# EAGLE design TripWire (EAGLE 6.1)
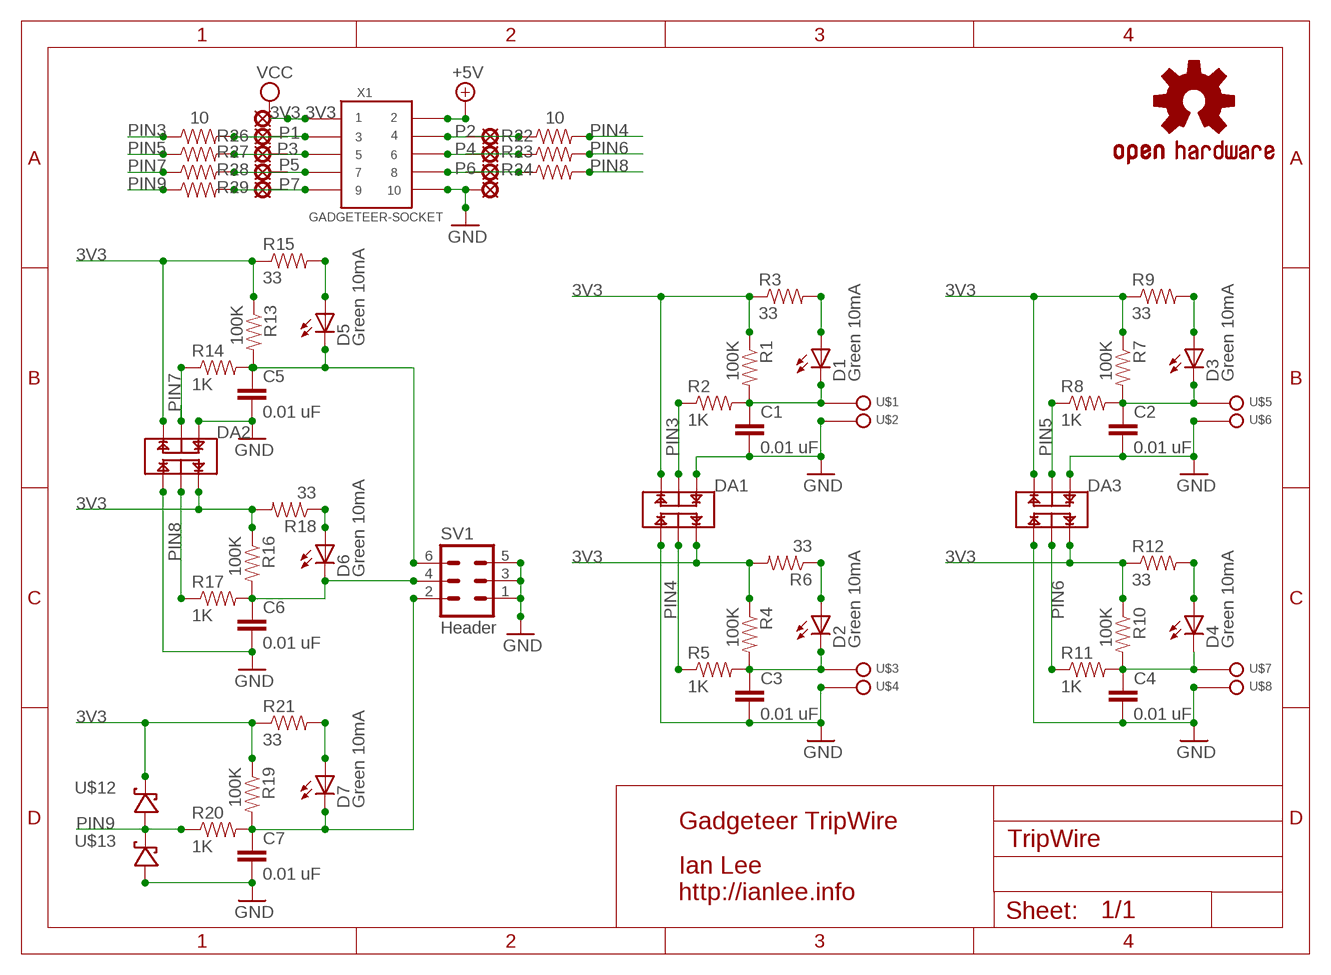
[diagram p0: schematic, sheet 1]

## Parts
3V3  LSP11  [LSP11]
C1  0.01 uF  CAP0603-CAP  [0603-CAP]
C2  0.01 uF  CAP0603-CAP  [0603-CAP]
C3  0.01 uF  CAP0603-CAP  [0603-CAP]
C4  0.01 uF  CAP0603-CAP  [0603-CAP]
C5  0.01 uF  CAP0603-CAP  [0603-CAP]
C6  0.01 uF  CAP0603-CAP  [0603-CAP]
C7  0.01 uF  CAP0603-CAP  [0603-CAP]
D1  Green 10mA  LED-YELLOW0603  [LED-0603]
D2  Green 10mA  LED-YELLOW0603  [LED-0603]
D3  Green 10mA  LED-YELLOW0603  [LED-0603]
D4  Green 10mA  LED-YELLOW0603  [LED-0603]
D5  Green 10mA  LED-YELLOW0603  [LED-0603]
D6  Green 10mA  LED-YELLOW0603  [LED-0603]
D7  Green 10mA  LED-YELLOW0603  [LED-0603]
DA1  BAT54SDW  [SOT-363]
DA2  BAT54SDW  [SOT-363]
DA3  BAT54SDW  [SOT-363]
GND  LSP11  [LSP11]
LOGO1  OSHW-LOGOM  [OSHW-LOGO-M]
P1  LSP11  [LSP11]
P2  LSP11  [LSP11]
P3  LSP11  [LSP11]
P4  LSP11  [LSP11]
P5  LSP11  [LSP11]
P6  LSP11  [LSP11]
P7  LSP11  [LSP11]
R1  100K  RESISTOR0603-RES  [0603-RES]
R2  1K  RESISTOR0603-RES  [0603-RES]
R3  33  RESISTOR0603-RES  [0603-RES]
R4  100K  RESISTOR0603-RES  [0603-RES]
R5  1K  RESISTOR0603-RES  [0603-RES]
R6  33  RESISTOR0603-RES  [0603-RES]
R7  100K  RESISTOR0603-RES  [0603-RES]
R8  1K  RESISTOR0603-RES  [0603-RES]
R9  33  RESISTOR0603-RES  [0603-RES]
R10  100K  RESISTOR0603-RES  [0603-RES]
R11  1K  RESISTOR0603-RES  [0603-RES]
R12  33  RESISTOR0603-RES  [0603-RES]
R13  100K  RESISTOR0603-RES  [0603-RES]
R14  1K  RESISTOR0603-RES  [0603-RES]
R15  33  RESISTOR0603-RES  [0603-RES]
R16  100K  RESISTOR0603-RES  [0603-RES]
R17  1K  RESISTOR0603-RES  [0603-RES]
R18  33  RESISTOR0603-RES  [0603-RES]
R19  100K  RESISTOR0603-RES  [0603-RES]
R20  1K  RESISTOR0603-RES  [0603-RES]
R21  33  RESISTOR0603-RES  [0603-RES]
R22  10  RESISTOR0603-RES  [0603-RES]
R23  10  RESISTOR0603-RES  [0603-RES]
R24  10  RESISTOR0603-RES  [0603-RES]
R26  10  RESISTOR0603-RES  [0603-RES]
R27  10  RESISTOR0603-RES  [0603-RES]
R28  10  RESISTOR0603-RES  [0603-RES]
R29  10  RESISTOR0603-RES  [0603-RES]
SV1  Header  MA03-2  [MA03-2]
U$1  SPADE-TERMINALPTH  [SPADE-TERMINAL]
U$2  SPADE-TERMINALPTH  [SPADE-TERMINAL]
U$3  SPADE-TERMINALPTH  [SPADE-TERMINAL]
U$4  SPADE-TERMINALPTH  [SPADE-TERMINAL]
U$5  SPADE-TERMINALPTH  [SPADE-TERMINAL]
U$6  SPADE-TERMINALPTH  [SPADE-TERMINAL]
U$7  SPADE-TERMINALPTH  [SPADE-TERMINAL]
U$8  SPADE-TERMINALPTH  [SPADE-TERMINAL]
U$12  BAT42-SCHOTTKY-DIODE  [SOD-523F]
U$13  BAT42-SCHOTTKY-DIODE  [SOD-523F]
X1  GADGETEER-SOCKET  [2X5_1.27MM]

## Nets
3V3 [power]: 3V3.MP DA1.P$1(C2) DA1.P$4(C1) DA2.P$1(C2) DA2.P$4(C1) DA3.P$1(C2) DA3.P$4(C1) R1.1 R3.1 R4.1 R6.2 R7.1 R9.1 R10.1 R12.1 R13.1 R15.1 R16.1 R18.2 R19.1 R21.1 U$12.P$1 X1.1 ; supply symbol labelled VCC
+5V: X1.2
GND [power]: C1.2 C2.2 C3.2 C4.2 C5.2 C6.2 C7.2 DA1.P$2(A2) DA1.P$3(A1) DA2.P$2(A2) DA2.P$3(A1) DA3.P$2(A2) DA3.P$3(A1) GND.MP SV1.1 SV1.3 SV1.5 U$2.P$1 U$4.P$1 U$6.P$1 U$8.P$1 U$13.P$2 X1.10
N$1: D1.A R3.2
N$2: C3.1 D2.C R4.2 R5.2 U$3.P$1
N$3: D2.A R6.1
N$4: C2.1 D3.C R7.2 R8.2 U$5.P$1
N$5: D3.A R9.2
N$6: C7.1 D7.C R19.2 R20.2 SV1.2
N$7: D4.A R12.2
N$8: C4.1 D4.C R10.2 R11.2 U$7.P$1
N$9: C6.1 D6.C R16.2 R17.2 SV1.4
N$10: D7.A R21.2
N$11: C1.1 D1.C R1.2 R2.2 U$1.P$1
N$12: D6.A R18.1
N$13: D5.A R15.2
N$14: C5.1 D5.C R13.2 R14.2 SV1.6
N$15: P2.MP R22.1 X1.4
N$16: P4.MP R23.1 X1.6
N$17: P6.MP R24.1 X1.8
N$18: P1.MP R26.2 X1.3
N$19: P3.MP R27.2 X1.5
N$20: P5.MP R28.2 X1.7
N$21: P7.MP R29.2 X1.9
PIN3: DA1.P$5(AC2) R2.1 R26.1
PIN4: DA1.P$0(AC1) R5.1 R22.2
PIN5: DA3.P$5(AC2) R8.1 R27.1
PIN6: DA3.P$0(AC1) R11.1 R23.2
PIN7: DA2.P$5(AC2) R14.1 R28.1
PIN8: DA2.P$0(AC1) R17.1 R24.2
PIN9: R20.1 R29.1 U$12.P$2 U$13.P$1

## Notes on the sheet
- Gadgeteer TripWire
- Ian Lee
  http://ianlee.info

## Library data of the parts
3V3 GND P1-P7 = solpad:LSP11: SOLDER PAD drill 1.1 mm
C1-C7 = SparkFun-Capacitors:CAP: Capacitor Standard 0603 ceramic capacitor, and 0.1" leaded capacitor.
D1-D7 = SparkFun-LED:LED-YELLOW: Yellow SMD LEDs LilyPad 1206- DIO-09909 0603- DIO-09003; PROD_ID: DIO-09003
DA1-DA3 = SoftDust:BAT54SDW
LOGO1 = SparkFun-Aesthetics:OSHW-LOGO: Open Source Hardware Logo This logo indicates the piece of hardware it is found on incorporates a OSHW license and/or adheres to the definition of open source hardware found here: http://freedomdefined.org/OSHW
R1-R24 R26-R29 = SparkFun-Resistors:RESISTOR: Resistor Basic schematic elements and footprints for 0603, 1206, and PTH resistors.
SV1 = con-lstb:MA03-2: PIN HEADER; OC_FARNELL: unknown; OC_NEWARK: unknown
U$1-U$8 = SoftDust:SPADE-TERMINAL
U$12 U$13 = SoftDust:BAT42-SCHOTTKY-DIODE
X1 = SoftDust:GADGETEER-SOCKET

## Net classes
0 default: width 0.152 mm, drill 0.254 mm, clearance 0.203 mm

## Board
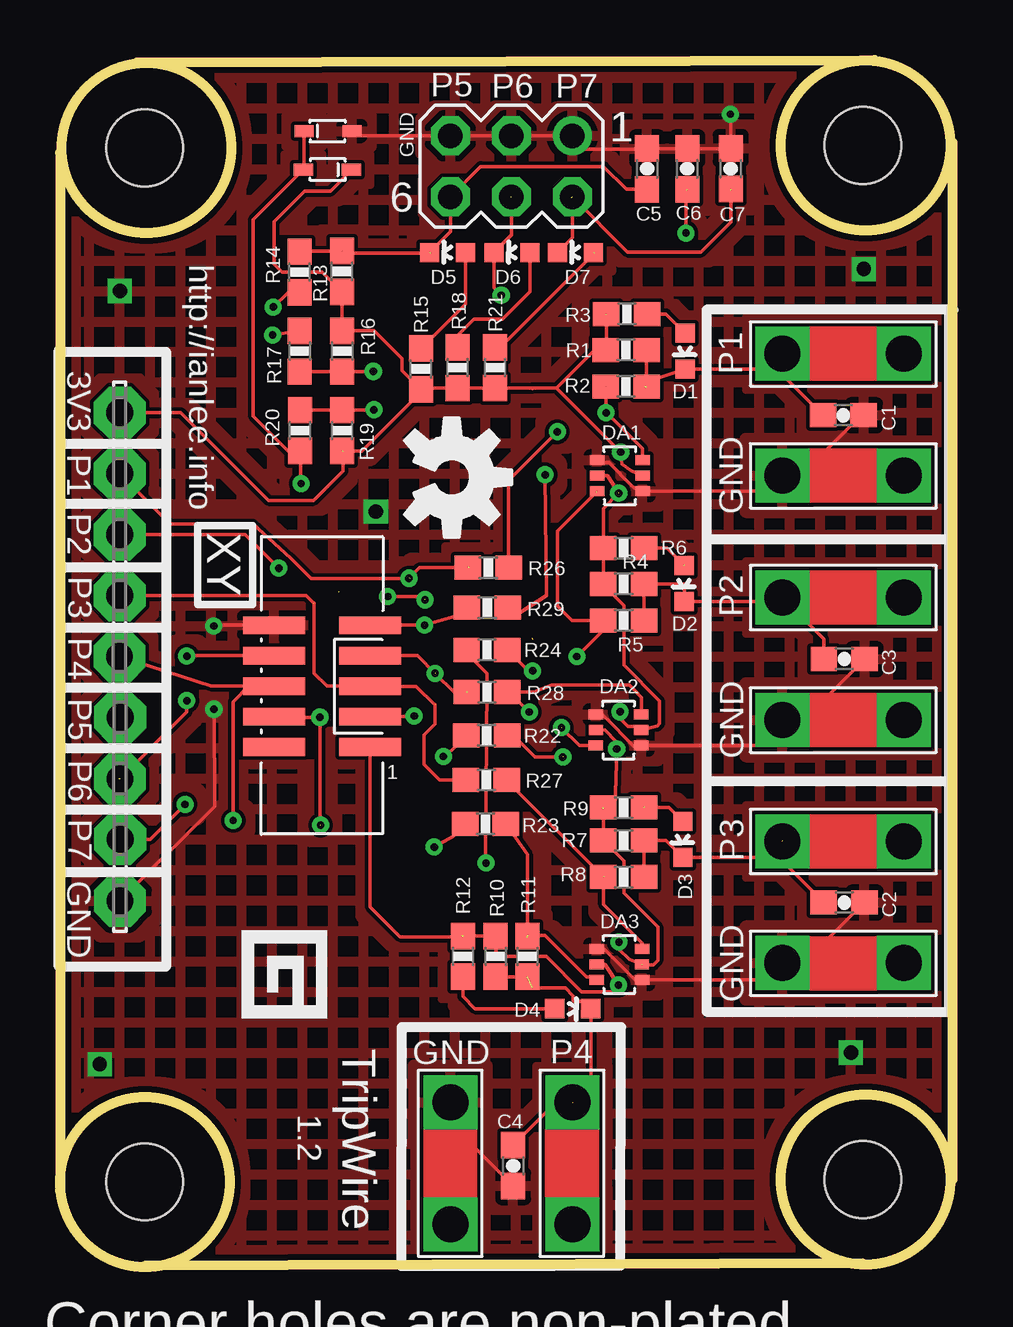
[diagram p1: board, top side]
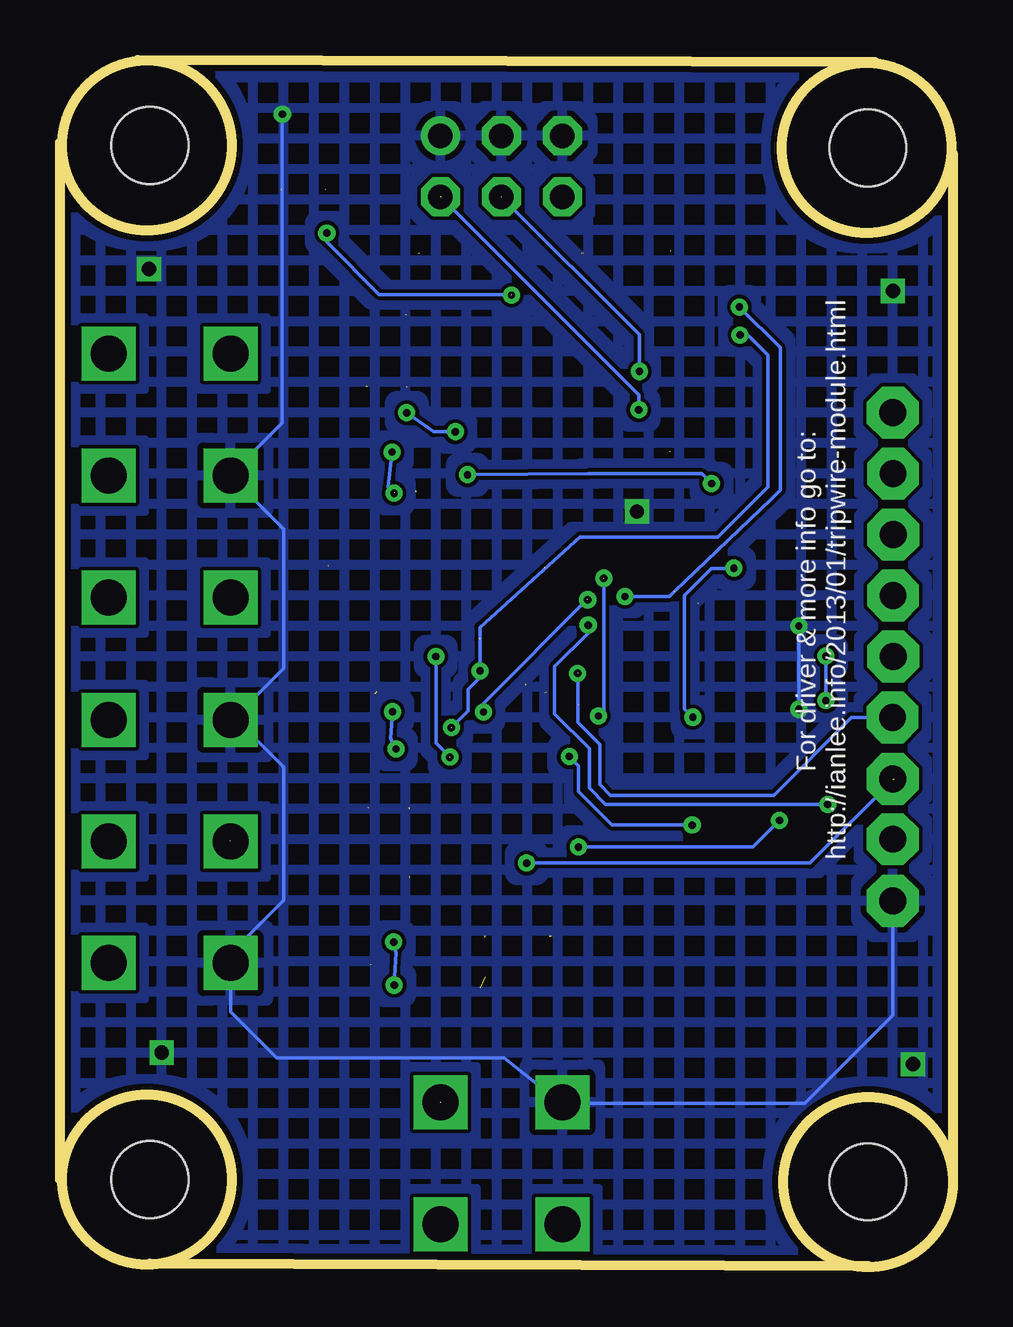
[diagram p2: board, bottom side, seen from below]

Size 37.22 x 50.3 mm. Coordinates in mm from the lower left corner, seen from the top.
Outline: 37.22,3.64 37.22,46.87
Outline: 0.01,46.42 0.01,3.18
Outline: 33.46,0.14 3.54,0.04
Outline: 3.21,50.2 33.97,50.3
Outline: circle at 33.59,3.64 radius 3.54
Outline: circle at 3.54,3.54 radius 3.54
Outline: circle at 33.59,46.74 radius 3.54
Outline: circle at 3.6,46.64 radius 3.54
Copper layers (1*16): Top 0.035mm / dielectric 1.5mm / Bottom 0.035mm
Design rules: minimum track width 6mil, minimum drill 12mil, track to track 6mil, track to pad 6mil, pad to pad 6mil, via to via 6mil, smd to smd 0mil, copper to edge 10mil, drill to drill 10mil, minimum pad ring 12mil, minimum via ring 8mil, stop-mask expansion 2mil, vias tented up to drill 25mil, thermal gap 10mil
Holes 3.2 mm at 3.54,3.54 33.46,3.64 3.54,46.64 33.46,46.74
tKeepout: area 2.1,45.2 to 5,48; area 27.1,45.2 to 30,48.1; area 2.1,2.1 to 5,5; area 27.1,2.1 to 30,5

### Footprints (pad centres in the part's own frame; a part is rotated, then mirrored left to right if it is on the bottom)
LSP11 = drill 1.118 pad 2.159 octagon: MP 0,0
0603-CAP = smd 1.1 x 1: 1 -0.85,0; 2 0.85,0
LED-0603 = smd 0.8 x 0.8: A 0,-0.75; C 0,0.75
SOT-363 = smd 0.42 x 0.6: P$0 -0.65,0.949; P$1 0,0.943; P$2 0.643,0.949; P$3 -0.65,-0.949; P$4 0,-0.943; P$5 0.643,-0.949
0603-RES = smd 1.1 x 1: 1 -0.85,0; 2 0.85,0
MA03-2 = drill 1.016: 1 -2.54,-1.27 | drill 1.016 octagon: 2 -2.54,1.27; 3 0,-1.27; 4 0,1.27; 5 2.54,-1.27; 6 2.54,1.27
SPADE-TERMINAL = drill 1.5 square: P$1 0,-2.54; P$2 0,2.54
SOD-523F = smd 0.5 x 0.8: P$1 0,1; P$2 0,-1
2X5_1.27MM = smd 2.6 x 0.74: 1 -2,2.58; 2 2,2.58; 3 -2,1.31; 4 2,1.31; 5 -2,0.04; 6 2,0.04; 7 -2,-1.23; 8 2,-1.23; 9 -2,-2.5; 10 2,-2.5

### Placement (x,y rotation side)
3V3  2.49,35.6 90 top
C1  32.66,35.49 0 top
C2  32.69,15.18 0 top
C3  32.69,25.33 0 top
C4  18.89,4.22 270 top
C5  24.48,45.76 90 top
C6  26.15,45.76 90 top
C7  27.97,45.77 90 top
D1  26.06,38.16 180 top
D2  26.02,28.48 180 top
D3  25.97,17.82 180 top
D4  21.38,10.76 270 top
D5  16.15,42.27 90 top
D6  18.84,42.27 90 top
D7  21.48,42.27 90 top
DA1  23.34,32.98 90 top
DA2  23.29,22.38 90 top
DA3  23.32,12.61 90 top
GND  2.5,15.25 90 top
LOGO1  16.34,32.9 270 top
P1  2.49,33.06 90 top
P2  2.48,30.52 90 top
P3  2.49,27.98 90 top
P4  2.48,25.44 90 top
P5  2.51,22.9 90 top
P6  2.5,20.33 90 top
P7  2.5,17.82 90 top
R1  23.6,38.21 0 top
R2  23.6,36.69 0 top
R3  23.63,39.71 0 top
R4  23.5,28.46 0 top
R5  23.5,26.93 0 top
R6  23.5,29.96 180 top
R7  23.5,17.76 0 top
R8  23.5,16.24 0 top
R9  23.5,19.14 0 top
R10  18.15,12.94 270 top
R11  19.48,12.94 270 top
R12  16.8,12.94 270 top
R13  11.75,41.49 90 top
R14  9.99,41.46 90 top
R15  15.04,37.42 90 top
R16  11.77,38.16 270 top
R17  9.99,38.16 270 top
R18  16.57,37.48 270 top
R19  11.77,34.86 90 top
R20  10.01,34.86 90 top
R21  18.14,37.48 90 top
R22  17.79,22.14 0 top
R23  17.74,18.46 0 top
R24  17.8,25.72 0 top
R26  17.85,29.15 180 top
R27  17.77,20.3 180 top
R28  17.8,23.95 180 top
R29  17.81,27.48 180 top
SV1  18.82,45.87 180 top
U$1  32.65,38.06 270 top
U$2  32.65,32.98 270 top
U$3  32.65,27.9 270 top
U$4  32.65,22.79 270 top
U$5  32.65,17.74 270 top
U$6  32.65,12.66 270 top
U$7  21.36,4.32 180 top
U$8  16.28,4.32 180 top
U$12  11.15,45.73 270 top
U$13  11.17,47.34 90 top
X1  10.93,24.24 180 top

### Tracks (layer width: path | path; a pad name or v marks a point on that pad's centre or on a via)
3V3  (via drill 0.3)  (7 unrouted)
  Top 0.154: 24.13,12.61 DA3.P$4 23.73,12.81 23.3,13.24 v23.3,13.54 | DA1.P$4 24.26,32.98 | 24.26,32.98 24.19,32.98 | DA2.P$4 24.1,22.38 | v23.35,23.14 23.41,22.8 23.68,22.52 24.08,22.52 DA2.P$4 | DA2.P$1 22.71,22.38 23.18,21.9 v23.21,21.58 23.13,19.14 R9.1 | 3V3.MP 5.03,35.6 8.69,31.94 10.57,31.94 11.79,33.16 11.79,33.97 | v23.29,32.24 22.65,31.6 R6.2 R4.1 22.65,28.42 23.5,27.57 23.5,25.08 25,23.58 25,22.64 24.9,22.54 DA2.P$4 | DA1.P$1 22.82,32.98 23.27,32.27 | 24.26,32.98 23.81,33.18 23.43,33.47 v23.37,33.95 20.7,36.63 | DA3.P$1 22.71,12.61 v23.28,11.74 23.01,11.47 21.75,11.47 20.28,12.94 18.27,12.94 18.17,13.04 18.17,13.78 R10.1 16.73,13.79 16.72,13.8 | R19.1 12.59,34.01 15.04,36.46 R15.1 | R15.1 15.09,36.63 R18.2 R21.1 19.69,36.63 | 19.69,36.63 19.69,36.61 | R15.1 14.26,37.36 14.26,37.86 13.09,39.02 11.78,39.02 R16.1 11.75,39.02 R13.1 10.93,41.46 9.25,41.46 8.92,41.79 8.92,43.57 10.19,44.84 11.28,44.84 12.15,45.7 U$12.P$1 | 22.71,19.14 22.65,19.07 R7.1 23.5,16.91 23.5,15.58 24.92,14.16 24.92,12.76 24.75,12.58 24.26,12.58 | 22.79,39.68 22.79,38.25 R1.1 22.29,38.21 20.7,36.63 | 20.7,36.63 19.69,36.63 | X1.1 12.93,15 14.18,13.75 16.8,13.75 16.82,13.78
  Bottom 0.154: v23.28,11.74 23.21,13.08 v23.3,13.54 | v23.37,33.95 23.54,32.5 v23.29,32.24 | v23.35,23.14 23.43,22.01 v23.21,21.58
GND  (via drill 0.3, 0.6)
  Top 0.154: DA3.P$2 22.67,13.25 23.96,11.96 DA3.P$3 29.4,11.96 U$6.P$1 31.02,12.66 C2.2 | DA1.P$2 22.48,33.53 22.91,33.53 22.91,33.49 23.83,32.57 24.11,32.33 DA1.P$3 29.48,32.33 30.11,32.95 | DA2.P$3 | DA2.P$2 22.61,23.02 24.02,21.61 24.13,21.73 DA2.P$3 | GND.MP 6.44,19.2 v6.42,23.24 | v6.41,26.71 6.45,26.74 X1.10 | C5.2 C6.2 C7.2 27.97,48.02 v27.95,48.04 | U$13.P$2 12.37,47.14 SV1.5 SV1.3 SV1.1 21.9,46.59 24.52,46.59 | C3.2 31,22.79 U$4.P$1 29.04,21.73 DA2.P$3 | C4.2 16.28,5.98 U$8.P$1 | 30.11,32.95 30.13,32.98 | C1.2 33.41,35.49 30.87,32.95 30.11,32.95
  Bottom 0.154: 16.37,6.86 18.71,8.7 18.72,8.71 28.2,8.71 30.11,10.62 U$6.P$1 30.11,13.07 27.9,15.28 27.9,20.84 29.83,22.77 30.13,22.77 | v6.42,23.24 6.41,23.62 v6.41,26.71 | 2.5,15.28 2.5,10.48 6.16,6.82 16.39,6.82 | U$2.P$1 29.47,32.34 | 30.13,32.98 27.9,30.74 27.9,24.93 30.08,22.74 | v27.95,48.04 27.95,35.16 30.16,32.95
  other vias: 2.5,40.68 33.51,41.59 1.66,8.44 32.98,8.93 13.16,31.48
  pour Bottom (isolate 0.016, hatched): -0.04,43.22 -0.02,46.52 0.13,47.64 0.77,48.73 1.45,49.49 2.5,50.02 3.44,50.25 34.02,50.28 34.93,50.02 35.57,49.69 36.07,49.29 36.66,48.52 37.01,47.71 37.17,47.05 37.22,46.49 37.22,3.64 37.01,2.68 36.63,1.74 36.05,1.05 35.31,0.52 34.52,0.21 33.97,0.11 3.64,0.01 2.83,0.06 2.17,0.26 1.56,0.62 1.02,1.03 0.39,1.92 0.06,2.73 0.01,3.29
  pour Top (isolate 0.016, hatched): -0.04,40.68 0.01,46.47 0.29,47.69 0.62,48.68 1.63,49.59 2.8,50.05 3.99,50.28 33.99,50.25 35.03,50 35.72,49.54 36.43,48.85 37.01,47.81 37.17,46.59 37.22,4.07 37.04,2.63 36.38,1.43 35.64,0.75 34.63,0.24 33.1,0.11 32.32,0.11 3.87,-0.02 2.55,0.09 1.43,0.65 0.62,1.48 0.08,2.63 -0.1,3.9
N$1
  Top 0.154: D1.A 25.26,39.71 R3.2
N$2
  Top 0.154: R5.2 R4.2 26.03,28.46 D2.C 29.94,27.73 U$3.P$1 31.84,26.16 C3.1
N$3  (1 unrouted)
  Top 0.154: R6.1 25.3,29.96 26.04,29.22
N$4  (1 unrouted)
  Top 0.154: R8.2 R7.2 25.27,17.76 D3.C 29.43,17.07 U$5.P$1 | C2.1 30.13,16.89 30.13,17.76
N$5  (1 unrouted)
  Top 0.154: D3.A 25.39,19.14 R9.2
N$6  (via drill 0.3)  (2 unrouted)
  Top 0.154: R20.2 R19.2 13.07,35.71 v13.09,35.72 | 27.97,45.18 C7.1 | D7.C 21.36,42.89 SV1.2 23.66,42.3 26.73,42.3 27.97,43.55 27.97,44.87
  Bottom 0.154: v13.09,35.72 13.09,36.33 21.32,44.56
N$7
  Top 0.154: R12.2 16.8,11.26 17.3,10.75 D4.A
N$8  (2 unrouted)
  Top 0.154: R11.2 R10.2 | C4.1 20.67,6.84 21.37,6.84 22.13,7.6 D4.C 21.83,11.06 21.44,11.06 21.39,11.11 21.39,11.29 21.06,11.62 19.69,11.62
N$9  (via drill 0.3)  (3 unrouted)
  Top 0.154: SV1.4 18.82,42.99 | 18.82,42.99 D6.C | R17.2 R16.2 13.05,37.31 v13.06,37.32 | v26.09,43.09 26.09,44.84 26.14,44.89 | 18.82,42.99 18.81,42.99 D6.C 18.09,40.8 v18.4,40.5
  Bottom 0.154: v13.06,37.32 13.06,38.85 18.8,44.59 | 18.4,40.52 23.91,40.52 26.09,42.71 v26.09,43.09
N$10  (1 unrouted)
  Top 0.154: R21.2 18.36,38.33 22.28,42.25
N$11  (1 unrouted)
  Top 0.154: R2.2 R1.2 | C1.1 30.11,37.19 U$1.P$1 29.46,37.41 D1.C 24.66,36.95 24.39,36.69
N$12
  Top 0.154: R18.1 16.57,38.82 17.25,39.51 18.45,39.51 19.59,40.65 D6.A
N$13
  Top 0.154: D5.A 16.9,40.13 R15.2
N$14  (2 unrouted)
  Top 0.154: D5.C 16.28,43.15 SV1.6 17.53,45.86 22.66,45.86 23.61,44.91 C5.1 | R14.2 10,42.33 11.77,42.33 11.84,42.25 15.47,42.25
N$15  (via drill 0.3)  (1 unrouted)
  Top 0.154: P2.MP 7.72,30.52 v9.12,29.12 | X1.4 8.95,22.91 v10.83,22.91 10.83,18.67 v10.86,18.41 | R22.1 16.34,21.54 v15.99,21.27
  Bottom 0.154: v10.83,22.91 11.18,23.25 11.18,27.99 10.06,29.1 9.14,29.1 v9.12,29.12 | v15.99,21.27 15.6,20.88 15.6,19.82 14.2,18.43 10.85,18.43
N$16  (via drill 0.3)
  Top 0.154: P4.MP 6.31,24.22 X1.6 7.87,24.2 7.22,23.55 v7.22,18.61 | v15.6,17.5 16.39,17.93 R23.1
  Bottom 0.154: v7.22,18.61 8.33,17.5 v15.6,17.5
N$17  (via drill 0.3)  (2 unrouted)
  Top 0.154: P6.MP 5.29,23.12 v5.29,23.6 | v5.29,25.45 5.31,25.47 X1.8 10.08,25.47 10.12,25.44 | 16.97,25.72 R24.1 16.95,25.44 17.1,25.44 17.81,24.72 17.81,24.24 | 17.81,24.29 17.74,17.46 v17.76,16.82
  Bottom 0.154: v5.29,23.6 v5.29,25.45 | 2.44,20.33 5.95,16.82 v17.76,16.82
N$18  (via drill 0.3)  (2 unrouted)
  Top 0.154: P1.MP 4.59,30.96 8.05,30.96 9.62,29.54 10.47,28.69 14.59,28.69 | v14.77,22.96 14.42,22.93 X1.3 | v14.55,28.7 14.99,29.14 17.05,29.14
  Bottom 0.154: 14.55,28.72 14.53,28.72 v14.55,28.7 14.55,23.18 v14.77,22.96
N$19  (2 unrouted)
  Top 0.154: P3.MP 10.26,27.98 10.6,27.65 | 15.63,23.42 14.85,24.2 X1.5 11.13,24.2 10.6,24.73 10.6,27.67 | R27.2 15.81,20.3 15.17,20.94 15.17,22.16 15.63,22.62 15.63,23.43
N$20  (via drill 0.3)  (2 unrouted)
  Top 0.154: R28.2 16.95,23.96 | X1.7 14.9,25.47 v15.64,24.74 16.44,23.94 17,23.94
  Bottom 0.154: P5.MP 4.22,22.9 7.46,19.65 14.27,19.65 14.71,20.1 14.71,21.78 15.63,22.69 15.63,24.75
N$21  (via drill 0.3)  (1 unrouted)
  Top 0.154: R29.2 16.66,27.17 v15.2,26.74 X1.9 | P7.MP 3.76,17.82 v5.21,19.27
  Bottom 0.154: v5.21,19.27 14.47,19.27 15.14,19.95 15.14,21.6 16.59,23.05 16.59,23.17 16.59,23.58 16.59,25.03 15.2,26.43 v15.2,26.76
PIN3  (via drill 0.3)  (1 unrouted)
  Top 0.154: R26.1 18.7,32.78 v20.73,34.81 | v22.76,35.6 22.76,35.62 | 22.76,35.62 22.76,36.69 | DA1.P$5 24.29,34.1 22.76,35.62
  Bottom 0.154: v20.73,34.81 21.65,34.81 v22.76,35.6
PIN4  (via drill 0.3)  (2 unrouted)
  Top 0.152: v21.55,25.44 22.82,26.71 R5.1 | 18.98,22.06 R22.2
  Top 0.154: R5.1 21.34,26.93 20.73,27.54 20.73,30.67 22.36,32.29 | 18.98,22.06 19.79,21.24 20.99,21.24
  Bottom 0.154: v20.96,21.24 21.55,21.83 v21.55,25.44
PIN5  (1 unrouted)
  Top 0.154: DA3.P$5 24.27,13.49 22.66,15.1 22.66,16.27 | R8.1 18.62,20.27 R27.1
PIN6  (2 unrouted)
  Top 0.154: R23.2 19.48,17.18 R11.1 | 19.87,13.73 19.49,13.73 | DA3.P$0 22.25,12.08 21.95,12.08 20.22,13.8 19.51,13.8
PIN7  (via drill 0.3)  (3 unrouted)
  Top 0.154: 23.99,23.97 24.23,23.73 DA2.P$5 | 24.09,23.89 23.73,24.24 20.52,24.24 19.77,23.95 R28.1 18.65,24.03 v19.55,23.12 v19.56,23.12 | v13.66,27.94 15.08,27.94 v15.22,27.8 | R14.1 9.5,40.61 v8.89,40
  Bottom 0.154: 11.61,28.14 7.57,32.01 7.56,32.01 7.19,32.37 7.19,38.31 v8.89,40 | v13.66,27.94 11.8,27.94 11.61,28.13 | v19.56,23.12 19.56,23.48 15.22,27.82
PIN8  (via drill 0.3)  (2 unrouted)
  Top 0.154: R17.1 v8.87,38.84 | DA2.P$0 21.65,21.73 20.91,22.46 | R24.2 19.53,24.84 v19.7,24.84
  Bottom 0.154: v8.87,38.84 8.54,38.84 7.7,38.01 7.7,32.51 9.78,30.43 15.54,30.43 19.72,26.65 19.72,26.15 | 19.7,26.21 v19.7,24.84 19.7,24.56 20.2,24.06 20.2,23.17 v20.9,22.47
PIN9  (via drill 0.3)
  Top 0.152: v20.23,33.01 20.28,27.98 18.98,27.14 R29.1 | 10.04,33.72 R20.1
  Top 0.154: U$13.P$1 10.17,45.76 U$12.P$2 8.06,43.64 8.06,35.47 9.52,34.01 R20.1 | v10.05,32.64 10.04,32.66 10.04,33.72
  Bottom 0.152: v20.23,33.01 15.2,33.06
  Bottom 0.154: v10.05,32.64 10.46,33.06 15.2,33.06

### Text on the board
tPlace: GND | http://ianlee.info | XY | GND | GND | GND | TripWire | GND | 1.2 | Corner holes are non-plated | black PCB with white text
bPlace: http://ianlee.info/2013/01/tripwire-module.html | For driver & more info go to:
tNames: P5 | P6 | P7 | P1 | P2 | P3 | P4